# Altium schematic sheet Test Pins.SchDoc: Optional ext. IO
size A4; Organization: Altium Limited; Address1: 3 Minna Close; Address2: Belrose; Address3: NSW 2085; Address4: Australia
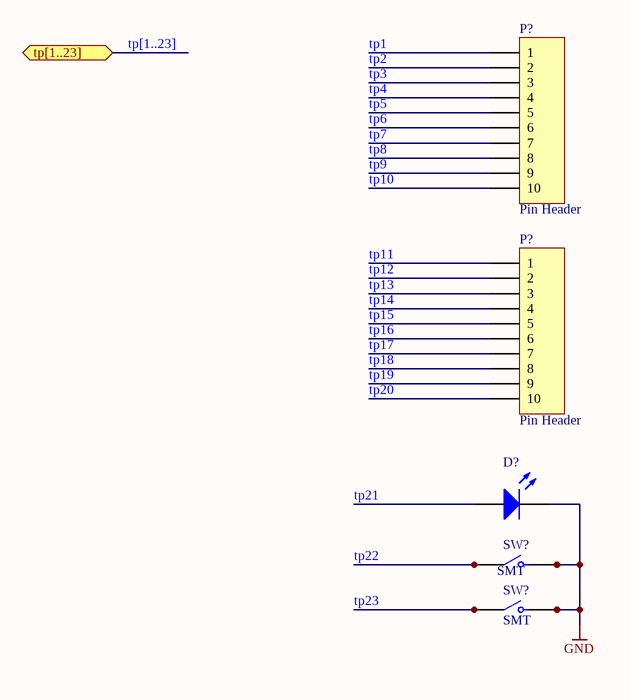
[diagram p0: Test Pins.SchDoc]

## Parts
(Parts that share a designator on the sheet are numbered #1, #2 ... from top to bottom, then left to right.)
D?  (no value)  [PLCC2]
P?#1  Pin Header  [PH1x10_2.54]
P?#2  Pin Header  [PH1x10_2.54]
SW?#1  SMT  [SWITCH TACT]
SW?#2  SMT  [SWITCH TACT]

## Ports
tp[1..23]

## Nets
GND: D?.2(K) SW?#1.2 SW?#1.3 SW?#2.2 SW?#2.3
tp1: P?#1.1
tp2: P?#1.2
tp3: P?#1.3
tp4: P?#1.4
tp5: P?#1.5
tp6: P?#1.6
tp7: P?#1.7
tp8: P?#1.8
tp9: P?#1.9
tp10: P?#1.10
tp11: P?#2.1
tp12: P?#2.2
tp13: P?#2.3
tp14: P?#2.4
tp15: P?#2.5
tp16: P?#2.6
tp17: P?#2.7
tp18: P?#2.8
tp19: P?#2.9
tp20: P?#2.10
tp21: D?.1(A)
tp22: SW?#1.1 SW?#1.4
tp23: SW?#2.1 SW?#2.4

## Buses and harness runs
bus tp[1..23] = port tp[1..23]

## Notes on the sheet
- Disclaimer
  Any design and information, hardware or software  is provided on an "as-is" basis without warranty of any kind and any express or implied warranties, including, but not limited to, the implied warranties of merchantability and fitness for a particular purpose are disclaimed. In no event shall wnpd (or KeaDrone)be liable for any direct, indirect, incidental, special, exemplary, or consequential damages (including, but not limited to, procurement of substitute goods or services; loss of use, data, or profits; or business interruption) however caused and on any theory of liability, whether in contract, strict liability, or tort (including negligence or otherwise) arising in any way out of the use of this firmware, hardware, software or information, even if wnpd (or KeaDrone) has been advised by user of the possibility of such potential loss or damage. The user agrees to hold wnpd (or KeaDrone) harmless from and against any and all claims, losses, liabilities and expenses.
- Title
- Size:
- Date:
- A4
- Name:
- Time:
- Ing. W. Pietersz
- Revision:
- Sheet
- of
- WillyPietersz@gmail.com
- Contact:
- -
- www.wnpd.nl
- File:

## Library data of the parts
D? = Green-PLCC2: LED, Surface Mount LED Indicator; Type: Single_Indicator; Part Number: Green-PLCC2; Author: Willem Pietersz; ROHS: Y; Supplier 2: Farnell; Supplier Part Number 2: 1328317; ComponentLink2Description: Datasheet; ComponentLink2URL: http://cp.literature.agilent.com/litweb/pdf/5988-6546EN.pdf
P?#1 P?#2 = PH1x10: Con1x10; Part Number: PH1x10; Pitch: 2.54; LatestRevision Note: Initial Release; Type: Pin Header; Number Of Pins: 10; Component Type: Standard; LatestRevision Date: 23-11-2010; Author: Willy Pietersz; Supplier 2: Farnell
SW?#1 SW?#2 = Pushbutton TACT: Switch; Current: 0.1; Voltage: 42; LatestRevision Note: Initial Release; Part Number: Pushbutton TACT; Component Type: Switch; LatestRevision Date: 4-10-2010; Author: Willem Pietersz; Supplier 2: Farnell; Supplier Part Number 2: 1795335; Number Of Pins: 4